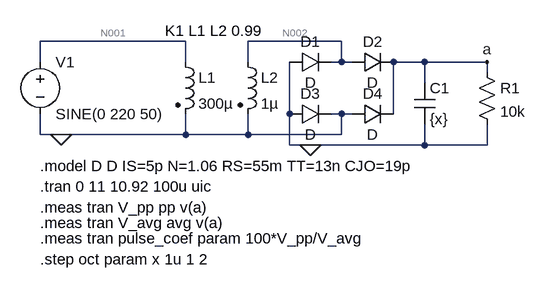
[diagram p0: schematic 2.3.1.asc]
2.3.1.asc, the LTspice schematic file:
Version 4
SHEET 1 1076 680
WIRE 320 80 96 80
WIRE 560 80 416 80
WIRE 96 112 96 80
WIRE 320 112 320 80
WIRE 416 112 416 80
WIRE 560 112 560 80
WIRE 560 112 544 112
WIRE 576 112 560 112
WIRE 688 112 640 112
WIRE 784 112 688 112
WIRE 784 128 784 112
WIRE 688 144 688 112
WIRE 480 192 480 112
WIRE 560 192 544 192
WIRE 576 192 560 192
WIRE 640 192 640 112
WIRE 96 224 96 192
WIRE 128 224 96 224
WIRE 320 224 320 192
WIRE 320 224 128 224
WIRE 416 224 416 192
WIRE 416 224 320 224
WIRE 560 224 560 192
WIRE 560 224 416 224
WIRE 480 240 480 192
WIRE 512 240 480 240
WIRE 688 240 688 208
WIRE 688 240 512 240
WIRE 784 240 784 208
WIRE 784 240 688 240
FLAG 128 224 0
FLAG 784 112 a
FLAG 512 240 0
SYMBOL voltage 96 96 R0
WINDOW 123 0 0 Left 0
WINDOW 39 0 0 Left 0
SYMATTR InstName V1
SYMATTR Value SINE(0 220 50)
SYMBOL ind2 304 96 R0
SYMATTR InstName L1
SYMATTR Value 300µ
SYMATTR SpiceLine Rser=10m
SYMATTR Type ind
SYMBOL ind2 400 96 R0
SYMATTR InstName L2
SYMATTR Value 1µ
SYMATTR SpiceLine Rser=10m
SYMATTR Type ind
SYMBOL cap 672 144 R0
SYMATTR InstName C1
SYMATTR Value {x}
SYMBOL res 768 112 R0
SYMATTR InstName R1
SYMATTR Value 10k
SYMBOL diode 480 128 R270
WINDOW 0 32 32 VTop 2
WINDOW 3 0 32 VBottom 2
SYMATTR InstName D1
SYMBOL diode 576 128 R270
WINDOW 0 32 32 VTop 2
WINDOW 3 0 32 VBottom 2
SYMATTR InstName D2
SYMBOL diode 480 208 R270
WINDOW 0 32 32 VTop 2
WINDOW 3 0 32 VBottom 2
SYMATTR InstName D3
SYMBOL diode 576 208 R270
WINDOW 0 32 32 VTop 2
WINDOW 3 0 32 VBottom 2
SYMATTR InstName D4
TEXT 96 272 Left 2 !.model D D IS=5p N=1.06 RS=55m TT=13n CJO=19p
TEXT 288 64 Left 2 !K1 L1 L2 0.99
TEXT 96 304 Left 2 !.tran 0 11 10.92 100u uic
TEXT 96 336 Left 2 !.meas tran V_pp pp v(a)
TEXT 96 360 Left 2 !.meas tran V_avg avg v(a)
TEXT 96 384 Left 2 !.meas tran pulse_coef param 100*V_pp/V_avg
TEXT 96 416 Left 2 !.step oct param x 1u 1 2

The netlist it stands for:
* 2.3.1.asc
V1 N001 0 SINE(0 220 50)
L1 N001 0 300µ Rser=10m
L2 N002 0 1µ Rser=10m
C1 a 0 {x}
R1 a 0 10k
D1 0 N002 D
D2 N002 a D
D3 0 0 D
D4 0 a D
.model D D
.lib standard.dio
.model D D IS=5p N=1.06 RS=55m TT=13n CJO=19p
K1 L1 L2 0.99
.tran 0 11 10.92 100u uic
.meas tran V_pp pp v(a)
.meas tran V_avg avg v(a)
.meas tran pulse_coef param 100*V_pp/V_avg
.step oct param x 1u 1 2
.backanno
.end

* Results of the author's LTspice run, read from the files saved beside the schematic
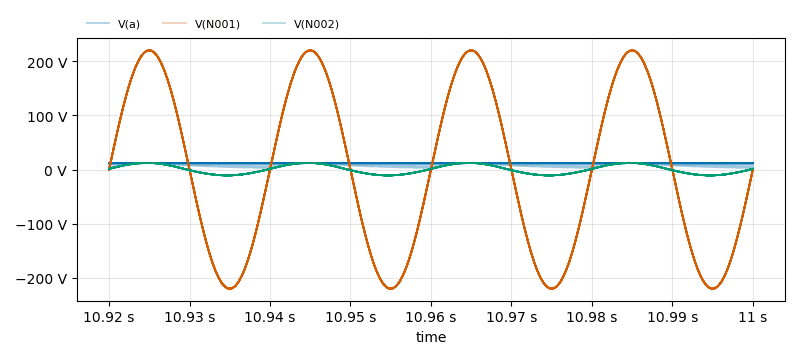
[diagram p1: Transient Analysis of 2.3.1.asc, plotted from the saved traces]
* Transient Analysis, 41 runs:
*   V(a) [run 1]: min 2.611 V, max 11.97 V, average 6.816 V, rms 7.437 V, last 2.728 V
*   V(a) [run 2]: min 5.329 V, max 11.97 V, average 8.511 V, rms 8.753 V, last 5.657 V
*   V(a) [run 3]: min 8.797 V, max 11.97 V, average 10.38 V, rms 10.43 V, last 9.167 V
*   V(a) [run 4]: min 10.67 V, max 11.96 V, average 11.32 V, rms 11.33 V, last 10.88 V
*   V(a) [run 5]: min 11.27 V, max 11.94 V, average 11.61 V, rms 11.61 V, last 11.4 V
*   V(a) [run 6]: min 11.68 V, max 11.92 V, average 11.8 V, rms 11.8 V, last 11.73 V
*   V(a) [run 7]: min 11.81 V, max 11.9 V, average 11.85 V, rms 11.85 V, last 11.83 V
*   V(a) [run 8]: min 11.84 V, max 11.88 V, average 11.86 V, rms 11.86 V, last 11.85 V
*   V(N001) [run 1]: min -220 V, max 220 V, average 22.89 mV, rms 155.6 V, last 0 V
*   V(N001) [run 2]: min -219.9 V, max 220 V, average 22.85 mV, rms 155.5 V, last 0 V
*   V(N001) [run 3]: min -219.9 V, max 220 V, average 24.03 mV, rms 155.6 V, last 0 V
*   V(N001) [run 4]: min -219.7 V, max 220 V, average 25.68 mV, rms 155.6 V, last 0 V
*   V(N001) [run 5]: min -220 V, max 220 V, average 24.94 mV, rms 155.6 V, last 0 V
*   V(N001) [run 6]: min -219.9 V, max 220 V, average 28.16 mV, rms 155.6 V, last 0 V
*   V(N001) [run 7]: min -220 V, max 220 V, average 26.97 mV, rms 155.6 V, last 0 V
*   V(N001) [run 8]: min -220 V, max 220 V, average 26.01 mV, rms 155.6 V, last 0 V
*   V(N002) [run 1]: min -10.71 V, max 12.5 V, average 549.6 mV, rms 8.24 V, last 1.317 V
*   V(N002) [run 2]: min -10.7 V, max 12.5 V, average 549.7 mV, rms 8.239 V, last 1.317 V
*   V(N002) [run 3]: min -10.7 V, max 12.5 V, average 549.7 mV, rms 8.24 V, last 1.317 V
*   V(N002) [run 4]: min -10.7 V, max 12.5 V, average 549.8 mV, rms 8.241 V, last 1.317 V
*   V(N002) [run 5]: min -10.71 V, max 12.5 V, average 549.8 mV, rms 8.241 V, last 1.317 V
*   V(N002) [run 6]: min -10.7 V, max 12.5 V, average 550 mV, rms 8.241 V, last 1.317 V
*   V(N002) [run 7]: min -10.71 V, max 12.5 V, average 550 mV, rms 8.241 V, last 1.317 V
*   V(N002) [run 8]: min -10.71 V, max 12.5 V, average 549.9 mV, rms 8.241 V, last 1.317 V
* From the log:
*   Measurement: v_pp
*     step  PP(v(a))  FROM  TO
*        1  9.35837  0  0.08
*        2  8.03063  0  0.08
*        3  6.64074  0  0.08
*        4  5.32046  0  0.08
*        5  4.15044  0  0.08
*        6  3.16854  0  0.08
*        7  2.37673  0  0.08
*        8  1.75836  0  0.08
*        9  1.28687  0  0.08
*       10  0.934022  0  0.08
*       11  0.673434  0  0.08
*       12  0.483207  0  0.08
*       13  0.345346  0  0.08
*       14  0.246234  0  0.08
*       15  0.175075  0  0.08
*       16  0.124241  0  0.08
*       17  0.0880575  0  0.08
*       18  0.0623188  0  0.08
*       19  0.0441389  0  0.08
*       20  0.0312138  0  0.08
*       21  0.0221004  0  0.08
*       22  0.0156031  0  0.08
*       23  0.0110416  0  0.08
*       24  0.00785065  0  0.08
*       25  0.00553608  0  0.08
*       26  0.00393105  0  0.08
*       27  0.00276852  0  0.08
*       28  0.0019722  0  0.08
*       29  0.00138283  0  0.08
*       30  0.000976563  0  0.08
*       31  0.000700951  0  0.08
*       32  0.000495911  0  0.08
*       33  0.000346184  0  0.08
*       34  0.000253677  0  0.08
*       35  0.000210762  0  0.08
*       36  0.000209808  0  0.08
*       37  0.000232697  0  0.08
*       38  0.000274658  0  0.08
*       39  0.000340462  0  0.08
*       40  0.00043869  0  0.08
*     ...
*   Measurement: v_avg
*     step  AVG(v(a))  FROM  TO
*        1  6.81608  0  0.08
*        2  7.68483  0  0.08
*        3  8.51147  0  0.08
*        4  9.24889  0  0.08
*        5  9.87401  0  0.08
*        6  10.3826  0  0.08
*        7  10.783  0  0.08
*        8  11.09  0  0.08
*        9  11.3202  0  0.08
*       10  11.4894  0  0.08
*       11  11.6117  0  0.08
*       12  11.6986  0  0.08
*       13  11.7588  0  0.08
*       14  11.7995  0  0.08
*       15  11.826  0  0.08
*       16  11.8422  0  0.08
*       17  11.8514  0  0.08
*       18  11.8565  0  0.08
*       19  11.8592  0  0.08
*       20  11.8605  0  0.08
*       21  11.8613  0  0.08
*       22  11.8616  0  0.08
*       23  11.8617  0  0.08
*       24  11.8619  0  0.08
*       25  11.8619  0  0.08
*       26  11.862  0  0.08
*       27  11.862  0  0.08
*       28  11.8621  0  0.08
*       29  11.8619  0  0.08
*       30  11.8619  0  0.08
*       31  11.8622  0  0.08
*       32  11.8621  0  0.08
*       33  11.862  0  0.08
*       34  11.8616  0  0.08
*       35  11.8603  0  0.08
*       36  11.8571  0  0.08
*       37  11.8515  0  0.08
*       38  11.8429  0  0.08
*       39  11.8308  0  0.08
*       40  11.8142  0  0.08
*     ...
*   Measurement: pulse_coef
*     step  100*v_pp/v_avg
*        1  137.298
*        2  104.5
*        3  78.0211
*        4  57.5254
*        5  42.0339
*        6  30.5178
*        7  22.0414
*        8  15.8554
*        9  11.3679
*       10  8.12941
*       11  5.79962
*       12  4.13048
*       13  2.93692
*       14  2.08682
*       15  1.48042
*       16  1.04914
*       17  0.743011
*       18  0.525609
*       19  0.372192
*       20  0.263173
*       21  0.186324
*       22  0.131543
*       23  0.0930862
*       24  0.0661835
*       25  0.0466712
*       26  0.0331398
*       27  0.0233394
*       28  0.016626
*       29  0.0116577
*       30  0.00823274
*       31  0.00590912
*       32  0.00418062
*       33  0.00291843
*       34  0.00213864
*       35  0.00177704
*       36  0.00176947
*       37  0.00196344
*       38  0.00231917
*       39  0.00287775
*       40  0.00371325
*     ...